# Altium schematic sheet 47.VI-Camera_MIPI-CSI.SchDoc
size 297 x 209 mm; Revision: V2.1; Schematic Page Number: 11; Page Number: 27; Check: <Checker>; Schematic Name: RK_NVR_DEMO1_RK3588_LP4/4x_V21; Page Count: 43; Page name: 47.VI-Camera_MIPI-CSI; Designer: Zhangdz; Schematic Page Count: 99; Revcode: V2.1; DsnPath: E:\Work\SBER\RK3588_SOM\temp\RK_NVR_DEMO1_RK3588_LP4XD200P232SD8_V21_20211228.DSN; SchematicName: RK_NVR_DEMO1_RK3588_LP4/4x_V21; PageName: 47.VI-Camera_MIPI-CSI; PageSize: A4; TopSchematic: True
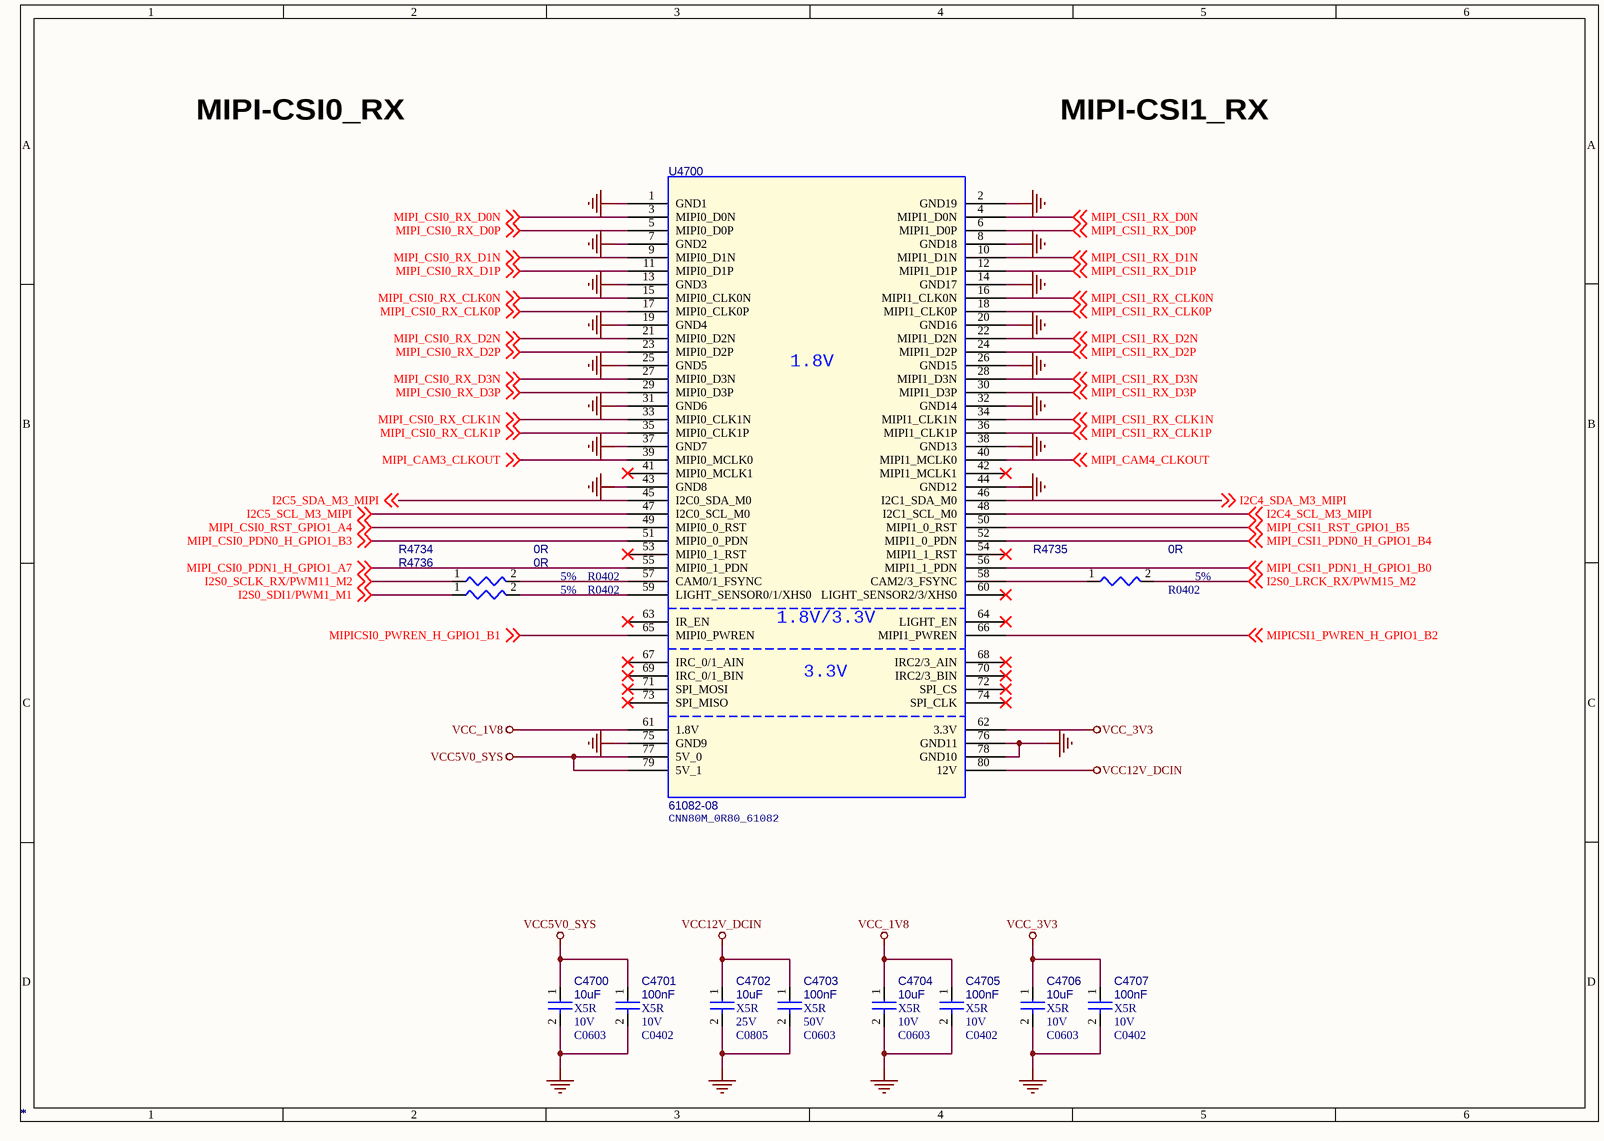
[diagram p0: 47.VI-Camera_MIPI-CSI.SchDoc]

## Parts
C4700  *  Voltage: 10V  Dielectric: X5R  [C0603]
C4701  *  Voltage: 10V  Dielectric: X5R  [C0402]
C4702  *  Voltage: 25V  Dielectric: X5R  [C0805]
C4703  *  Voltage: 50V  Dielectric: X5R  [C0603]
C4704  *  Voltage: 10V  Dielectric: X5R  [C0603]
C4705  *  Voltage: 10V  Dielectric: X5R  [C0402]
C4706  *  Voltage: 10V  Dielectric: X5R  [C0603]
C4707  *  Voltage: 10V  Dielectric: X5R  [C0402]
R4734  *  Tolerance: 5%  [R0402]
R4735  *  Tolerance: 5%  [R0402]
R4736  *  Tolerance: 5%  [R0402]
U4700  *  [CNN80M_0R80_61082]

## Nets
GND: C4700.2 C4701.2 C4702.2 C4703.2 C4704.2 C4705.2 C4706.2 C4707.2 U4700.1(GND1) U4700.2(GND19) U4700.7(GND2) U4700.8(GND18) U4700.13(GND3) U4700.14(GND17) U4700.19(GND4) U4700.20(GND16) U4700.25(GND5) U4700.26(GND15) U4700.31(GND6) U4700.32(GND14) U4700.37(GND7) U4700.38(GND13) U4700.43(GND8) U4700.44(GND12) U4700.75(GND9) U4700.76(GND11) U4700.78(GND10)
VCC5V0_SYS: C4700.1 C4701.1 U4700.77(5V_0) U4700.79(5V_1)
VCC12V_DCIN: C4702.1 C4703.1 U4700.80(12V)
VCC_1V8: C4704.1 C4705.1 U4700.61(1.8V)
VCC_3V3: C4706.1 C4707.1 U4700.62(3.3V)
I2C4_SCL_M3_MIPI: U4700.48(I2C1_SCL_M0) ; off-sheet I2C4_SCL_M3_MIPI
I2C4_SDA_M3_MIPI: U4700.46(I2C1_SDA_M0) ; off-sheet I2C4_SDA_M3_MIPI
I2C5_SCL_M3_MIPI: U4700.47(I2C0_SCL_M0) ; off-sheet I2C5_SCL_M3_MIPI
I2C5_SDA_M3_MIPI: U4700.45(I2C0_SDA_M0) ; off-sheet I2C5_SDA_M3_MIPI
I2S0_LRCK_RX/PWM15_M2: R4735.2 ; off-sheet I2S0_LRCK_RX/PWM15_M2
I2S0_SCLK_RX/PWM11_M2: R4734.1 ; off-sheet I2S0_SCLK_RX/PWM11_M2
I2S0_SDI1/PWM1_M1: R4736.1 ; off-sheet I2S0_SDI1/PWM1_M1
MIPI_CAM3_CLKOUT: U4700.39(MIPI0_MCLK0) ; off-sheet MIPI_CAM3_CLKOUT
MIPI_CAM4_CLKOUT: U4700.40(MIPI1_MCLK0) ; off-sheet MIPI_CAM4_CLKOUT
MIPI_CSI0_PDN0_H_GPIO1_B3: U4700.51(MIPI0_0_PDN) ; off-sheet MIPI_CSI0_PDN0_H_GPIO1_B3
MIPI_CSI0_PDN1_H_GPIO1_A7: U4700.55(MIPI0_1_PDN) ; off-sheet MIPI_CSI0_PDN1_H_GPIO1_A7
MIPI_CSI0_RST_GPIO1_A4: U4700.49(MIPI0_0_RST) ; off-sheet MIPI_CSI0_RST_GPIO1_A4
MIPI_CSI0_RX_CLK0N: U4700.15(MIPI0_CLK0N) ; off-sheet MIPI_CSI0_RX_CLK0N
MIPI_CSI0_RX_CLK0P: U4700.17(MIPI0_CLK0P) ; off-sheet MIPI_CSI0_RX_CLK0P
MIPI_CSI0_RX_CLK1N: U4700.33(MIPI0_CLK1N) ; off-sheet MIPI_CSI0_RX_CLK1N
MIPI_CSI0_RX_CLK1P: U4700.35(MIPI0_CLK1P) ; off-sheet MIPI_CSI0_RX_CLK1P
MIPI_CSI0_RX_D0N: U4700.3(MIPI0_D0N) ; off-sheet MIPI_CSI0_RX_D0N
MIPI_CSI0_RX_D0P: U4700.5(MIPI0_D0P) ; off-sheet MIPI_CSI0_RX_D0P
MIPI_CSI0_RX_D1N: U4700.9(MIPI0_D1N) ; off-sheet MIPI_CSI0_RX_D1N
MIPI_CSI0_RX_D1P: U4700.11(MIPI0_D1P) ; off-sheet MIPI_CSI0_RX_D1P
MIPI_CSI0_RX_D2N: U4700.21(MIPI0_D2N) ; off-sheet MIPI_CSI0_RX_D2N
MIPI_CSI0_RX_D2P: U4700.23(MIPI0_D2P) ; off-sheet MIPI_CSI0_RX_D2P
MIPI_CSI0_RX_D3N: U4700.27(MIPI0_D3N) ; off-sheet MIPI_CSI0_RX_D3N
MIPI_CSI0_RX_D3P: U4700.29(MIPI0_D3P) ; off-sheet MIPI_CSI0_RX_D3P
MIPI_CSI1_PDN0_H_GPIO1_B4: U4700.52(MIPI1_0_PDN) ; off-sheet MIPI_CSI1_PDN0_H_GPIO1_B4
MIPI_CSI1_PDN1_H_GPIO1_B0: U4700.56(MIPI1_1_PDN) ; off-sheet MIPI_CSI1_PDN1_H_GPIO1_B0
MIPI_CSI1_RST_GPIO1_B5: U4700.50(MIPI1_0_RST) ; off-sheet MIPI_CSI1_RST_GPIO1_B5
MIPI_CSI1_RX_CLK0N: U4700.16(MIPI1_CLK0N) ; off-sheet MIPI_CSI1_RX_CLK0N
MIPI_CSI1_RX_CLK0P: U4700.18(MIPI1_CLK0P) ; off-sheet MIPI_CSI1_RX_CLK0P
MIPI_CSI1_RX_CLK1N: U4700.34(MIPI1_CLK1N) ; off-sheet MIPI_CSI1_RX_CLK1N
MIPI_CSI1_RX_CLK1P: U4700.36(MIPI1_CLK1P) ; off-sheet MIPI_CSI1_RX_CLK1P
MIPI_CSI1_RX_D0N: U4700.4(MIPI1_D0N) ; off-sheet MIPI_CSI1_RX_D0N
MIPI_CSI1_RX_D0P: U4700.6(MIPI1_D0P) ; off-sheet MIPI_CSI1_RX_D0P
MIPI_CSI1_RX_D1N: U4700.10(MIPI1_D1N) ; off-sheet MIPI_CSI1_RX_D1N
MIPI_CSI1_RX_D1P: U4700.12(MIPI1_D1P) ; off-sheet MIPI_CSI1_RX_D1P
MIPI_CSI1_RX_D2N: U4700.22(MIPI1_D2N) ; off-sheet MIPI_CSI1_RX_D2N
MIPI_CSI1_RX_D2P: U4700.24(MIPI1_D2P) ; off-sheet MIPI_CSI1_RX_D2P
MIPI_CSI1_RX_D3N: U4700.28(MIPI1_D3N) ; off-sheet MIPI_CSI1_RX_D3N
MIPI_CSI1_RX_D3P: U4700.30(MIPI1_D3P) ; off-sheet MIPI_CSI1_RX_D3P
MIPICSI0_PWREN_H_GPIO1_B1: U4700.65(MIPI0_PWREN) ; off-sheet MIPICSI0_PWREN_H_GPIO1_B1
MIPICSI1_PWREN_H_GPIO1_B2: U4700.66(MIPI1_PWREN) ; off-sheet MIPICSI1_PWREN_H_GPIO1_B2
NetR4734_2: R4734.2 U4700.57(CAM0/1_FSYNC)
NetR4735_1: R4735.1 U4700.58(CAM2/3_FSYNC)
NetR4736_2: R4736.2 U4700.59(LIGHT_SENSOR0/1/XHS0)

Not connected (* = marked no-connect by the designer): U4700 41(MIPI0_MCLK1)* 42(MIPI1_MCLK1)* 53(MIPI0_1_RST)* 54(MIPI1_1_RST)* 60(LIGHT_SENSOR2/3/XHS0)* 63(IR_EN)* 64(LIGHT_EN)* 67(IRC_0/1_AIN)* 68(IRC2/3_AIN)* 69(IRC_0/1_BIN)* 70(IRC2/3_BIN)* 71(SPI_MOSI)* 72(SPI_CS)* 73(SPI_MISO)* 74(SPI_CLK)*

## Notes on the sheet
- MIPI-CSI0_RX
- MIPI-CSI1_RX
- (in symbol 61082-08) 1.8V/3.3V

## Library data of the parts
C4700 = CAP NP: cap,10.00uF,+/-10%,10V,X5R,C0603; Part Reference: C4700; Manufacturer: TDK; Value: 10uF; RK PN: C1608X5R1A106K080AC; Priority: A; Tolerance: 10%; PCB Footprint: C0603; Part Type: C0603; Manufacturer PN: C1608X5R1A106K080AC; Created by: JJJ
C4701 = CAP NP: cap,100.00nF,+/-10%,10V,X5R,C0402; Part Reference: C4701; Manufacturer PN: C1005X5R1A104K050BA; Manufacturer: TDK; Value: 100nF; Tolerance: 10%; Priority: A; PCB Footprint: C0402; Created by: JJJ; Part Type: C0402; RK PN: C1005X5R1A104K050BA
C4702 = CAP NP: cap,10.00uF,+/-10%,25V,X5R,C0805; Part Reference: C4702; Manufacturer: TDK; Value: 10uF; RK PN: C2012X5R1E106K085AC; Priority: A; Tolerance: 10%; PCB Footprint: C0805; Part Type: C0805; Manufacturer PN: C2012X5R1E106K085AC; Created by: JJJ
C4703 = CAP NP: cap,100.00nF,+/-10%,50V,X5R,C0603; Part Reference: C4703; Manufacturer PN: C1608X5R1H104K080AA; Manufacturer: TDK; Value: 100nF; Tolerance: 10%; Priority: A; PCB Footprint: C0603; Created by: JJJ; Part Type: C0603; RK PN: C1608X5R1H104K080AA
C4704 = CAP NP: cap,10.00uF,+/-10%,10V,X5R,C0603; Part Reference: C4704; Manufacturer: TDK; Value: 10uF; RK PN: C1608X5R1A106K080AC; Priority: A; Tolerance: 10%; PCB Footprint: C0603; Part Type: C0603; Manufacturer PN: C1608X5R1A106K080AC; Created by: JJJ
C4705 = CAP NP: cap,100.00nF,+/-10%,10V,X5R,C0402; Part Reference: C4705; Manufacturer PN: C1005X5R1A104K050BA; Manufacturer: TDK; Value: 100nF; Tolerance: 10%; Priority: A; PCB Footprint: C0402; Created by: JJJ; Part Type: C0402; RK PN: C1005X5R1A104K050BA
C4706 = CAP NP: cap,10.00uF,+/-10%,10V,X5R,C0603; Part Reference: C4706; Manufacturer: TDK; Value: 10uF; RK PN: C1608X5R1A106K080AC; Priority: A; Tolerance: 10%; PCB Footprint: C0603; Part Type: C0603; Manufacturer PN: C1608X5R1A106K080AC; Created by: JJJ
C4707 = CAP NP: cap,100.00nF,+/-10%,10V,X5R,C0402; Part Reference: C4707; Manufacturer: TDK; Value: 100nF; RK PN: C1005X5R1A104K050BA; Priority: A; Tolerance: 10%; PCB Footprint: C0402; Part Type: C0402; Manufacturer PN: C1005X5R1A104K050BA; Created by: JJJ
R4734 = RESISTOR_Dup1: НЁУГєсД¤µзЧи,0R,+/-5%,R0402,1/16W.; Part Reference: R4734; Manufacturer: YAGEO; RK PN: RC0402JR-070RL; Priority: A; Wattage: 1/16W; PCB Footprint: R0402; Value: 0R; Part Type: НЁУГєсД¤µзЧи; Manufacturer PN: RC0402JR-070RL; Created by: YTL
R4735 = RESISTOR_Dup1: НЁУГєсД¤µзЧи,0R,+/-5%,R0402,1/16W.; Part Reference: R4735; Manufacturer: YAGEO; RK PN: RC0402JR-070RL; Priority: A; Wattage: 1/16W; PCB Footprint: R0402; Value: 0R; Part Type: НЁУГєсД¤µзЧи; Manufacturer PN: RC0402JR-070RL; Created by: YTL
R4736 = RESISTOR_Dup1: НЁУГєсД¤µзЧи,0R,+/-5%,R0402,1/16W.; Part Reference: R4736; Manufacturer PN: RC0402JR-070RL; Manufacturer: YAGEO; Wattage: 1/16W; Priority: A; PCB Footprint: R0402; Value: 0R; Created by: YTL; Part Type: НЁУГєсД¤µзЧи; RK PN: RC0402JR-070RL
U4700 = 61082-08: Part Reference: U4700; Value: 61082-08; PCB Footprint: CNN80M_0R80_61082